# Altium schematic sheet REV_2025.SchDoc
size A3; SheetNumber: 1; SheetTotal: 1
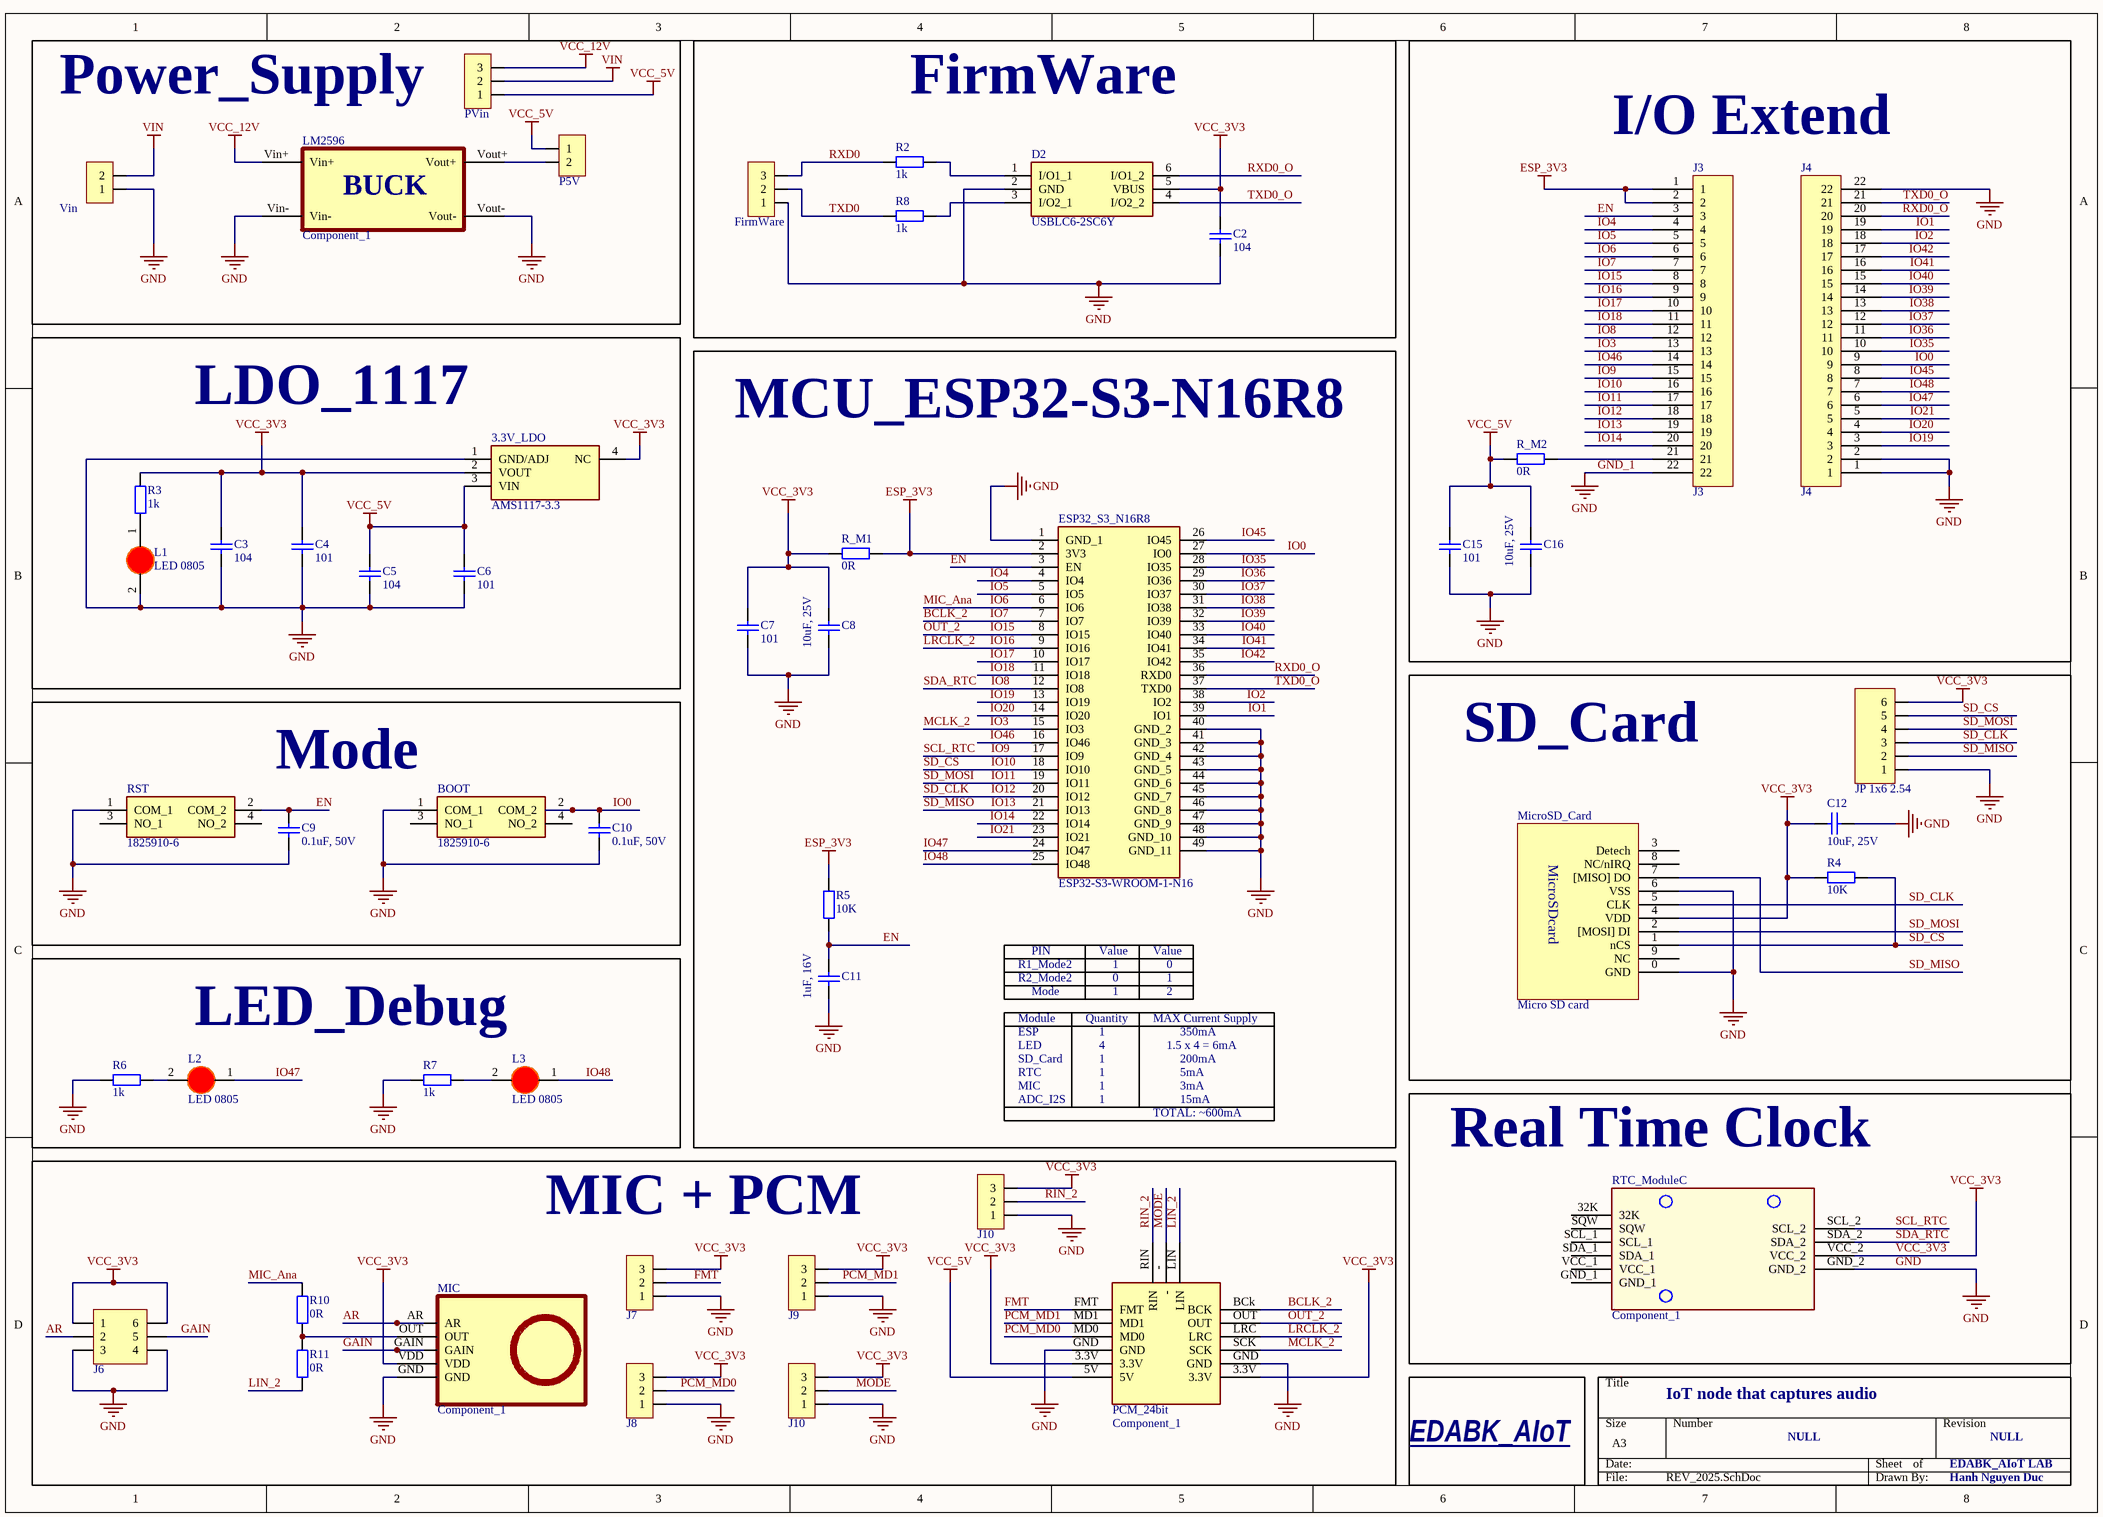
[diagram p0: REV_2025.SchDoc]

## Parts
3.3V_LDO  AMS1117-3.3  [SOT229P700X180-4N]
BOOT  1825910-6  [18259106]
C2  104  [tu 0603]
C3  104  [tu 0603]
C4  101  [tu 0805]
C5  104  [tu 0603]
C6  101  [tu 0805]
C7  101  [tu 0805]
C8  10uF, 25V  [tu 0603]
C9  0.1uF, 50V  [tu 0603]
C10  0.1uF, 50V  [tu 0603]
C11  1uF, 16V  [tu 0603]
C12  10uF, 25V  [tu 0603]
C15  101  [tu 0805]
C16  10uF, 25V  [tu 0603]
D2  USBLC6-2SC6Y  [SOT95P280X145-6N]
ESP32_S3_N16R8  ESP32-S3-WROOM-1-N16  [ESP32S3WROOM1N16]
FirmWare  FirmWare  [JP 1x3 DC]
FMT  J7  [JP 1x3 DT]
J3  J3  [PCBComponent_1]
J4  J4  [PCBComponent_1]
JP3  JP 1x6 2.54  [JP 1x6 DT]
L1  LED 0805  [LED-0805-Red]
L2  LED 0805  [LED-0805-Red]
L3  LED 0805  [LED-0805-Red]
LM2596  Component_1  [PCBComponent_1]
MD0  J8  [JP 1x3 DT]
MD1  J9  [JP 1x3 DT]
MIC  Component_1  [PCBComponent_1]
MIC_Mode  J6  [JP 2x3 DT]
MicroSD_Card  Micro SD card  [MicroSD]
P5V  P5V  [JP 1x2 DT]
PCM_24bit  Component_1  [PCBComponent_1]
PVin  PVin  [JP 1x3 DT]
R2  1k  [tro smd 0805]
R3  1k  [tro smd 0805]
R4  10K  [tro smd 0805]
R5  10K  [tro smd 0805]
R6  1k  [tro smd 0805]
R7  1k  [tro smd 0805]
R8  1k  [tro smd 0805]
R10  0R  [tro smd 0603]
R11  0R  [tro smd 0603]
R-L  J10  [JP 1x3 DT]
R_M1  0R  [tro smd 0603]
R_M2  0R  [tro smd 0603]
RIN  J10  [JP 1x3 DT]
RST  1825910-6  [18259106]
RTC_Module  Component_1  [PCBComponent_1]  (part C of 3)
Vin  Vin  [JP 1x2 DC]

## Blocks framed on the sheet
Power_Supply: LM2596 P5V PVin Vin
FirmWare: C2 D2 FirmWare R2 R8
I/O Extend: C15 C16 J3 J4 R_M2
LDO_1117: 3.3V_LDO C3-C6 L1 R3
MCU_ESP32-S3-N16R8: C7 C8 C11 ESP32_S3_N16R8 R5 R_M1
SD_Card: C12 JP3 MicroSD_Card R4
Mode: BOOT C9 C10 RST
LED_Debug: L2 L3 R6 R7
Real Time Clock: RTC_Module
MIC + PCM: FMT MD0 MD1 MIC MIC_Mode PCM_24bit R10 R11 R-L RIN

## Nets
ESP_3V3: ESP32_S3_N16R8.2(3V3) J3.1 J3.2 R5.1 R_M1.1
GND: 3.3V_LDO.1(GND/ADJ) BOOT.1(COM_1) C2.2 C3.2 C4.2 C5.2 C6.2 C7.2 C8.2 C9.2 C10.2 C11.2 C12.2 C15.2 C16.2 D2.2(GND) ESP32_S3_N16R8.1(GND_1) ESP32_S3_N16R8.40(GND_2) ESP32_S3_N16R8.41(GND_3) ESP32_S3_N16R8.42(GND_4) ESP32_S3_N16R8.43(GND_5) ESP32_S3_N16R8.44(GND_6) ESP32_S3_N16R8.45(GND_7) ESP32_S3_N16R8.46(GND_8) ESP32_S3_N16R8.47(GND_9) ESP32_S3_N16R8.48(GND_10) ESP32_S3_N16R8.49(GND_11) FirmWare.1 FMT.1 J3.22 J4.1 J4.2 J4.22 JP3.1 L1.2(K) LM2596.Vin- LM2596.Vout- MD0.1 MD1.1 MIC.GND MIC_Mode.3 MIC_Mode.4 MicroSD_Card.0(GND) MicroSD_Card.6(VSS) PCM_24bit.GND R6.2 R7.2 R-L.1 RIN.1 RST.1(COM_1) RTC_Module.GND_2 Vin.1  [also labelled GND_1]
VCC_3V3: 3.3V_LDO.2(VOUT) 3.3V_LDO.4(NC) C2.1 C3.1 C4.1 C7.1 C8.1 C12.1 D2.5(VBUS) FMT.3 JP3.6 MD0.3 MD1.3 MIC.VDD MIC_Mode.1 MIC_Mode.6 MicroSD_Card.4(VDD) PCM_24bit.3.3V R3.2 R4.1 R-L.3 R_M1.2 RIN.3 RTC_Module.VCC_2
VCC_5V: 3.3V_LDO.3(VIN) C5.1 C6.1 C15.1 C16.1 P5V.1 PCM_24bit.5V PVin.1 R_M2.2
VCC_12V: LM2596.Vin+ PVin.3
VIN: PVin.2 Vin.2
AR: MIC.AR MIC_Mode.2
BCLK_2: ESP32_S3_N16R8.7(IO7) J3.7 PCM_24bit.BCk(BCK)  [also labelled IO7]
EN: C9.1 C11.1 ESP32_S3_N16R8.3(EN) J3.3 R5.2 RST.2(COM_2)
FMT: FMT.2 PCM_24bit.FMT
GAIN: MIC.GAIN MIC_Mode.5
IO0: BOOT.2(COM_2) C10.1 ESP32_S3_N16R8.27(IO0) J4.9
IO1: ESP32_S3_N16R8.39(IO1) J4.19
IO2: ESP32_S3_N16R8.38(IO2) J4.18
IO3: ESP32_S3_N16R8.15(IO3) J3.13 PCM_24bit.SCK  [also labelled MCLK_2]
IO4: ESP32_S3_N16R8.4(IO4) J3.4
IO5: ESP32_S3_N16R8.5(IO5) J3.5
IO6: ESP32_S3_N16R8.6(IO6) J3.6 R10.2  [also labelled MIC_Ana]
IO8: ESP32_S3_N16R8.12(IO8) J3.12 RTC_Module.SDA_2  [also labelled SDA_RTC]
IO9: ESP32_S3_N16R8.17(IO9) J3.15 RTC_Module.SCL_2  [also labelled SCL_RTC]
IO10: ESP32_S3_N16R8.18(IO10) J3.16 JP3.5 MicroSD_Card.1(nCS) R4.2  [also labelled SD_CS]
IO11: ESP32_S3_N16R8.19(IO11) J3.17 JP3.4 MicroSD_Card.2([MOSI]_DI)  [also labelled SD_MOSI]
IO12: ESP32_S3_N16R8.20(IO12) J3.18 JP3.3 MicroSD_Card.5(CLK)  [also labelled SD_CLK]
IO13: ESP32_S3_N16R8.21(IO13) J3.19 JP3.2 MicroSD_Card.7([MISO]_DO)  [also labelled SD_MISO]
IO14: ESP32_S3_N16R8.22(IO14) J3.20
IO15: ESP32_S3_N16R8.8(IO15) J3.8 PCM_24bit.OUT  [also labelled OUT_2]
IO16: ESP32_S3_N16R8.9(IO16) J3.9 PCM_24bit.LRC  [also labelled LRCLK_2]
IO17: ESP32_S3_N16R8.10(IO17) J3.10
IO18: ESP32_S3_N16R8.11(IO18) J3.11
IO19: ESP32_S3_N16R8.13(IO19) J4.3
IO20: ESP32_S3_N16R8.14(IO20) J4.4
IO21: ESP32_S3_N16R8.23(IO21) J4.5
IO35: ESP32_S3_N16R8.28(IO35) J4.10
IO36: ESP32_S3_N16R8.29(IO36) J4.11
IO37: ESP32_S3_N16R8.30(IO37) J4.12
IO38: ESP32_S3_N16R8.31(IO38) J4.13
IO39: ESP32_S3_N16R8.32(IO39) J4.14
IO40: ESP32_S3_N16R8.33(IO40) J4.15
IO41: ESP32_S3_N16R8.34(IO41) J4.16
IO42: ESP32_S3_N16R8.35(IO42) J4.17
IO45: ESP32_S3_N16R8.26(IO45) J4.8
IO46: ESP32_S3_N16R8.16(IO46) J3.14
IO47: ESP32_S3_N16R8.24(IO47) J4.6 L2.1(A)
IO48: ESP32_S3_N16R8.25(IO48) J4.7 L3.1(A)
LIN_2: PCM_24bit.LIN R11.1
MODE: PCM_24bit.- R-L.2
PCM_MD0: MD0.2 PCM_24bit.MD0
PCM_MD1: MD1.2 PCM_24bit.MD1
RIN_2: PCM_24bit.RIN RIN.2
RXD0: FirmWare.3 R2.2
RXD0_O: D2.6(I/O1_2) ESP32_S3_N16R8.36(RXD0) J4.20
TXD0: FirmWare.2 R8.2
TXD0_O: D2.4(I/O2_2) ESP32_S3_N16R8.37(TXD0) J4.21
NetD2_1: D2.1(I/O1_1) R2.1
NetD2_3: D2.3(I/O2_1) R8.1
NetJ3_21: J3.21 R_M2.1
NetL1_1: L1.1(A) R3.1
NetL2_2: L2.2(K) R6.1
NetL3_2: L3.2(K) R7.1
NetLM2596_Vout+: LM2596.Vout+ P5V.2
NetMIC_OUT: MIC.OUT R10.1 R11.2

Not connected (* = marked no-connect by the designer): BOOT 3(NO_1) 4(NO_2); MicroSD_Card 3(Detech) 8(NC/nIRQ) 9(NC); RST 3(NO_1) 4(NO_2); RTC_Module 32K GND_1 SCL_1 SDA_1 SQW VCC_1

## Notes on the sheet
- R1_Mode2
- R2_Mode2
- PIN
- Mode
- Value
- 1
- 0
- 2
- Module
- ESP
- LED
- SD_Card
- Quantity
- 4
- MAX Current Supply
- 1.5 x 4 = 6mA
- 350mA
- 200mA
- RTC
- MIC
- ADC_I2S
- TOTAL: ~600mA
- 5mA
- 3mA
- 15mA
- IoT node that captures audio
- EDABK_AIoT
- NULL
- EDABK_AIoT LAB
- Hanh Nguyen Duc
- (in symbol Component_1) BUCK
- (in symbol Micro SD card) MicroSDcard

## Library data of the parts
3.3V_LDO = AMS1117-3.3: Integrated Circuit; Manufacturer_Name: Advanced; Datasheet Link: https://datasheet.datasheetarchive.com/originals/distributors/Datasheets-28/DSA-550594.pdf; Height: 1.8mm; Manufacturer_Part_Number: AMS1117-3.3
BOOT RST = 1825910-6: Switch; Manufacturer_Name: TE Connectivity; Datasheet Link: https://www.te.com/commerce/DocumentDelivery/DDEController?Action=srchrtrv&DocNm=1308111-1_SWITCHES_CORE_PROGRAM_CATALOG&DocType=Catalog%20Section&DocLang=English&PartCntxt=1825910-6&DocFormat=pdf; Height: 5.3mm; Manufacturer_Part_Number: 1825910-6; Mouser Part Number: 650-1825910-6; Mouser Price/Stock: https://www.mouser.co.uk/ProductDetail/TE-Connectivity/1825910-6?qs=A6cQTCBcXncisYDS1KbpGA%3D%3D; Arrow Part Number: 1825910-6; Arrow Price/Stock: https://www.arrow.com/en/products/1825910-6/te-connectivity?utm_currency=USD&region=europe
C2 C3 C5 C8 C11 C12 C16 = Tu 0603 104 50V 10%: Dán; Don_Vi: Con; So_Chan: 2; Ten_Linh_Kien: Tụ 0603 104-100nF 10% 50V; Ma_Hang: MH004568; Chung_Loai: Dán; Kieu_Chan: *
C4 C6 C7 C15 = Tu 0805 101 50V 20%: Dán; Don_Vi: Con; So_Chan: 2; Ten_Linh_Kien: Tụ 0805 101-0.1nF 50V 20%; Ma_Hang: MH002806; Chung_Loai: Dán; Kieu_Chan: *
C9 C10 = Tu 0603 103 50V 10%: Dán; Don_Vi: Con; So_Chan: 2; Ten_Linh_Kien: Tụ 0603 103-10nF 10% 50V; Ma_Hang: MH004567; Chung_Loai: Dán; Kieu_Chan: *
D2 = USBLC6-2SC6Y: Diode; Manufacturer_Name: STMicroelectronics; Datasheet Link: https://componentsearchengine.com/Datasheets/1/USBLC6-2SC6Y.pdf; Height: 1.45mm; Manufacturer_Part_Number: USBLC6-2SC6Y; Mouser Part Number: 511-USBLC6-2SC6Y; Mouser Price/Stock: https://www.mouser.co.uk/ProductDetail/STMicroelectronics/USBLC6-2SC6Y?qs=gNDSiZmRJS%2FOgDexvXkdow%3D%3D; Arrow Part Number: USBLC6-2SC6Y; Arrow Price/Stock: https://www.arrow.com/en/products/usblc6-2sc6y/stmicroelectronics?utm_currency=USD&region=nac
ESP32_S3_N16R8 = ESP32-S3-WROOM-1-N16: Integrated Circuit; Manufacturer_Name: Espressif Systems; Datasheet Link: https://www.espressif.com/sites/default/files/documentation/esp32-s3-wroom-1_wroom-1u_datasheet_en.pdf; Height: 3.25mm; Manufacturer_Part_Number: ESP32-S3-WROOM-1-N16; Mouser Part Number: 356-ESP32S3WROOM1N16; Mouser Price/Stock: https://www.mouser.co.uk/ProductDetail/Espressif-Systems/ESP32-S3-WROOM-1-N16?qs=Li%252BoUPsLEntjPrtJwwS5Pw%3D%3D
FirmWare = JP 1x3 2.54 Duc Cong: Cắm; Ten_Linh_Kien: Jump Đơn Đực 2.54MM 1x40P Cong Đứng; Don_Vi: Con; Ma_Hang: MH000904; Ghi_Chu: *; Kieu_Chan: *; Chung_Loai: Cắm
FMT MD0 MD1 PVin R-L RIN = JP 1x3 2.54 Duc Thang: Cắm; Ten_Linh_Kien: Jump Đơn Đực 2.54MM 1x40P Thẳng 11MM; Don_Vi: Con; Ma_Hang: MH000903; Ghi_Chu: *; Kieu_Chan: *; Chung_Loai: Cắm
J3 J4 = Component_1
JP3 = JP 1x6 2.54 Duc Thang: Cắm; Ten_Linh_Kien: Jump Đơn Đực 2.54MM 1x40P Thẳng 11MM; Don_Vi: Con; Ma_Hang: MH000903; Ghi_Chu: *; Kieu_Chan: *; Chung_Loai: Cắm
L1-L3 = LED 0805 Do: Dán; Don_Vi: Con; Ma_Hang: MH000897; Ten_Linh_Kien: LED 0805 Màu Đỏ (Red); Ghi_Chu: *; Kieu_Chan: *; Chung_Loai: Dán
MIC_Mode = JP 2x3 2.54 Duc Thang: Cắm; Ten_Linh_Kien: Jump Đôi Đực 2.54MM 2x40P Thẳng 11MM; Don_Vi: Con; Ma_Hang: MH002686; Ghi_Chu: *; Kieu_Chan: *; Chung_Loai: Cắm
P5V = JP 1x2 2.54 Duc Thang: Cắm; Ten_Linh_Kien: Jump Đơn Đực 2.54MM 1x40P Thẳng 11MM; Don_Vi: Con; Ma_Hang: MH000903; Ghi_Chu: *; Kieu_Chan: *; Chung_Loai: Cắm
R2-R8 = Tro 0805 1% 1k: Dán; Don_Vi: Con; So_Chan: 2; Ten_Linh_Kien: Trở 0805 1% 1k; Ma_Hang: MH005468; Chung_Loai: Dán; Kieu_Chan: *
R10 R11 R_M1 R_M2 = Tro 0603 1% 0R: Dán; Don_Vi: Con; So_Chan: 2; Ten_Linh_Kien: Trở 0603 1% 0R; Ma_Hang: MH005792; Chung_Loai: Dán; Kieu_Chan: *
Vin = JP 1x2 2.54 Duc Cong: Cắm; Ten_Linh_Kien: Jump Đơn Đực 2.54MM 1x40P Cong Đứng; Don_Vi: Con; Ma_Hang: MH000904; Ghi_Chu: *; Kieu_Chan: *; Chung_Loai: Cắm